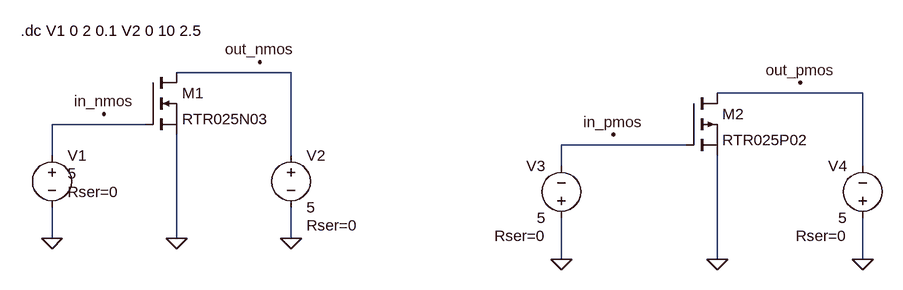
[diagram p0: schematic mosfet_tranzistor.asc]
mosfet_tranzistor.asc, the LTspice schematic file:
Version 4
SHEET 1 880 680
WIRE -720 16 -896 16
WIRE 160 48 -64 48
WIRE -944 96 -1088 96
WIRE -112 128 -304 128
WIRE -1088 144 -1088 96
WIRE -720 144 -720 16
WIRE -304 160 -304 128
WIRE 160 160 160 48
WIRE -1088 272 -1088 224
WIRE -896 272 -896 112
WIRE -720 272 -720 224
WIRE -304 304 -304 240
WIRE -64 304 -64 144
WIRE 160 304 160 240
FLAG -1088 272 0
FLAG -720 272 0
FLAG -896 272 0
FLAG -304 304 0
FLAG -64 304 0
FLAG 160 304 0
FLAG -768 0 out_nmos
FLAG -1008 80 in_nmos
FLAG 64 32 out_pmos
FLAG -224 112 in_pmos
SYMBOL voltage -720 128 R0
WINDOW 123 0 0 Left 2
WINDOW 39 24 124 Left 2
SYMATTR InstName V2
SYMATTR Value 5
SYMATTR SpiceLine Rser=0
SYMBOL voltage -1088 128 R0
WINDOW 3 24 44 Left 2
WINDOW 123 0 0 Left 2
WINDOW 39 24 72 Left 2
SYMATTR InstName V1
SYMATTR Value 5
SYMATTR SpiceLine Rser=0
SYMBOL nmos -944 16 R0
SYMATTR InstName M1
SYMATTR Value RTR025N03
SYMBOL voltage -304 256 R180
WINDOW 0 24 96 Left 2
WINDOW 3 24 16 Left 2
WINDOW 123 0 0 Left 2
WINDOW 39 24 -12 Left 2
SYMATTR InstName V3
SYMATTR Value 5
SYMATTR SpiceLine Rser=0
SYMBOL voltage 160 256 R180
WINDOW 0 24 96 Left 2
WINDOW 3 24 16 Left 2
WINDOW 123 0 0 Left 2
WINDOW 39 24 -12 Left 2
SYMATTR InstName V4
SYMATTR Value 5
SYMATTR SpiceLine Rser=0
SYMBOL pmos -112 48 R0
SYMATTR InstName M2
SYMATTR Value RTR025P02
TEXT -1136 -48 Left 2 !.dc V1 0 2 0.1 V2 0 10 2.5

The netlist it stands for:
* mosfet_tranzistor.asc
V2 N001 0 5 Rser=0
V1 N003 0 5 Rser=0
M1 N001 N003 0 0 RTR025N03
V3 0 N004 5 Rser=0
V4 0 N002 5 Rser=0
M2 N002 N004 0 0 RTR025P02
.model NMOS NMOS
.model PMOS PMOS
.lib standard.mos
.dc V1 0 2 0.1 V2 0 10 2.5
.backanno
.end